# EAGLE schematic regsimple2addfp (EAGLE 7.6.0)

## Sheet 1 of 2: BUS
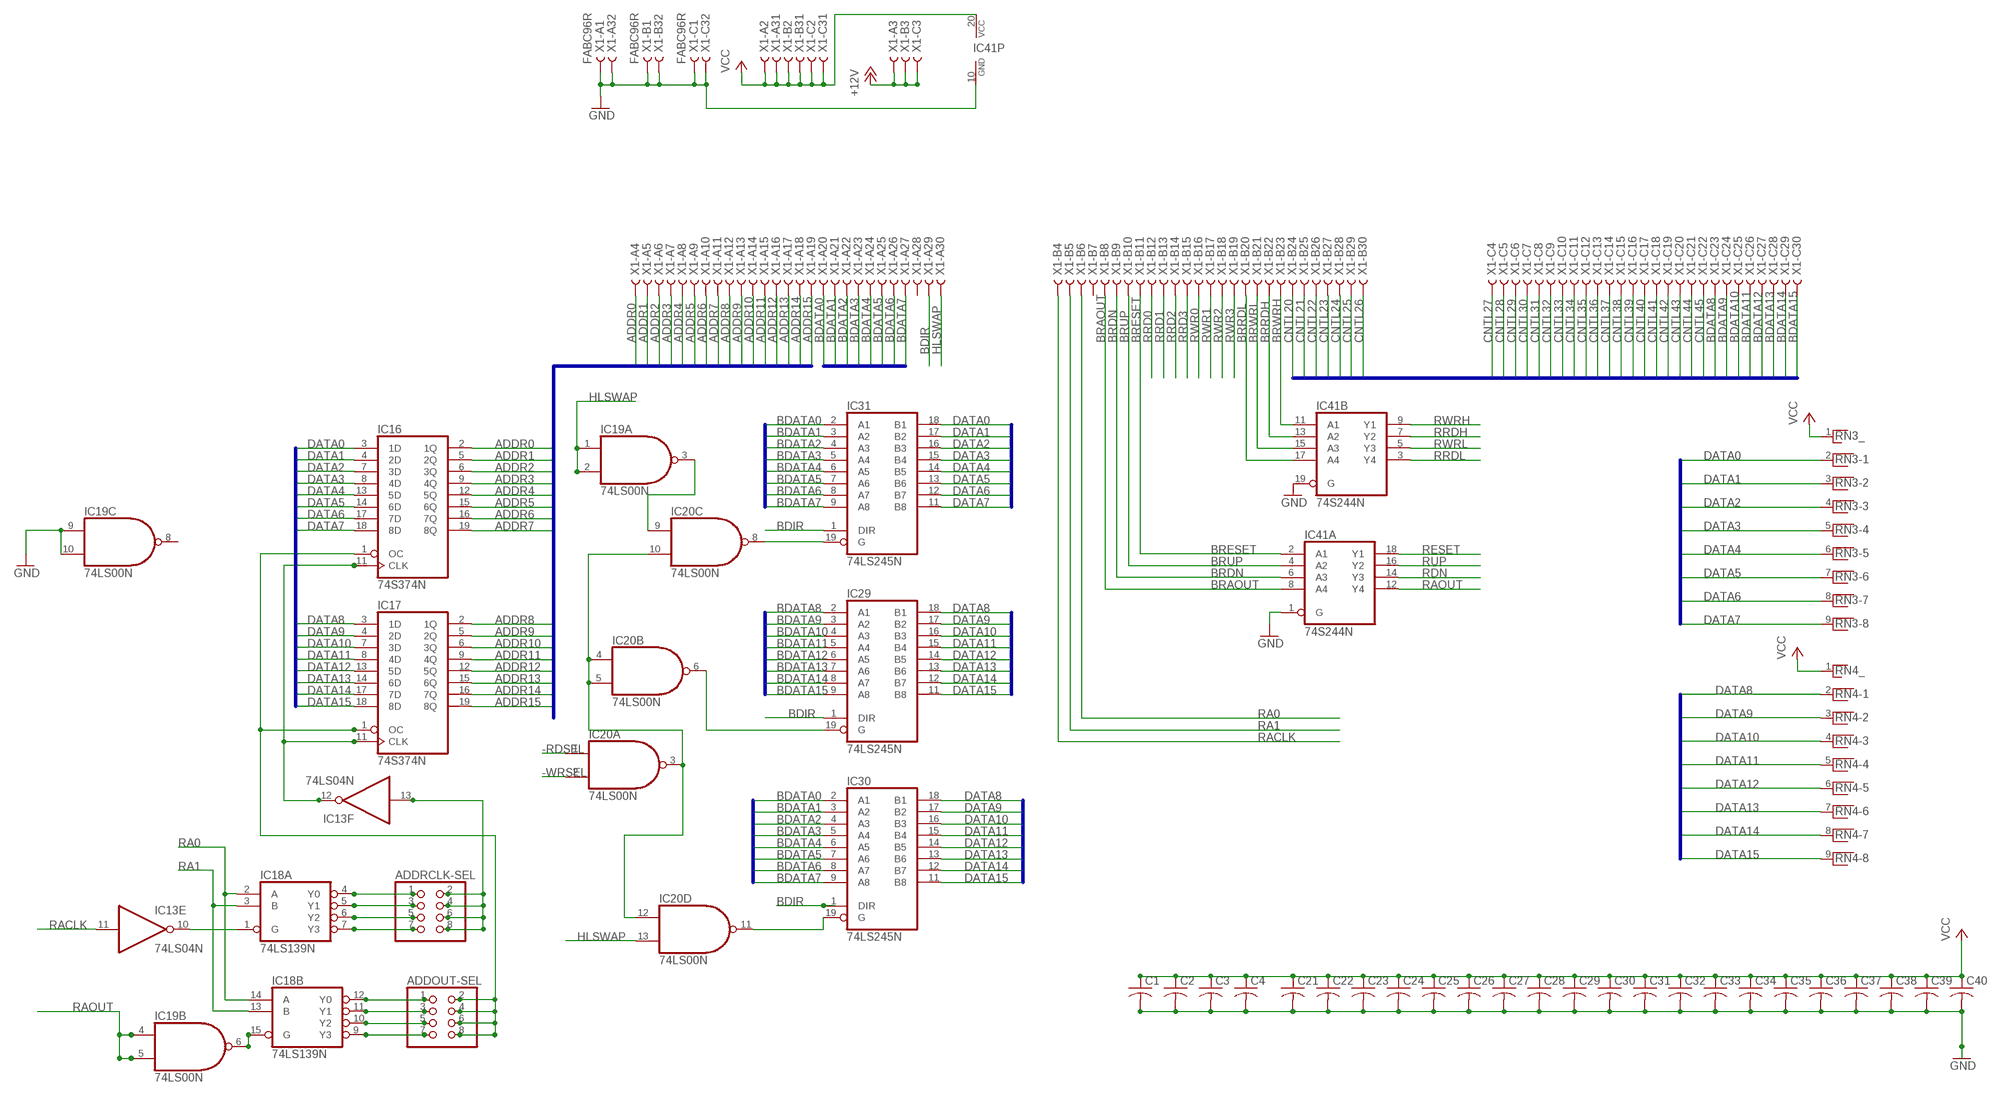
[diagram p0: schematic, sheet 1]

### Parts
ADDOUT-SEL  PINHD-2X4  [2X04]
ADDRCLK-SEL  PINHD-2X4  [2X04]
C1  C-US025-040X050  [C025-040X050]
C2  C-US025-040X050  [C025-040X050]
C3  C-US025-040X050  [C025-040X050]
C4  C-US025-040X050  [C025-040X050]
C21  C-US025-040X050  [C025-040X050]
C22  C-US025-040X050  [C025-040X050]
C23  C-US025-040X050  [C025-040X050]
C24  C-US025-040X050  [C025-040X050]
C25  C-US025-040X050  [C025-040X050]
C26  C-US025-040X050  [C025-040X050]
C27  C-US025-040X050  [C025-040X050]
C28  C-US025-040X050  [C025-040X050]
C29  C-US025-040X050  [C025-040X050]
C30  C-US025-040X050  [C025-040X050]
C31  C-US025-040X050  [C025-040X050]
C32  C-US025-040X050  [C025-040X050]
C33  C-US025-040X050  [C025-040X050]
C34  C-US025-040X050  [C025-040X050]
C35  C-US025-040X050  [C025-040X050]
C36  C-US025-040X050  [C025-040X050]
C37  C-US025-040X050  [C025-040X050]
C38  C-US025-040X050  [C025-040X050]
C39  C-US025-040X050  [C025-040X050]
C40  C-US025-040X050  [C025-040X050]
IC13  74LS04N  [DIL14]
IC16  74S374N  [DIL20]
IC17  74S374N  [DIL20]
IC18  74LS139N  [DIL16]
IC19  74LS00N  [DIL14]
IC20  74LS00N  [DIL14]
IC29  74LS245N  [DIL20]
IC30  74LS245N  [DIL20]
IC31  74LS245N  [DIL20]
IC41  74S244N  [DIL20]
RN3  RNX8  [RN-9]
RN4  RNX8  [RN-9]
X1  FABC96R  [FABC96R]

### Nets
+12V: X1.A3 X1.B3 X1.C3
-RDSEL: IC20.1(A:I0) ; also sheet 2
-WRSEL: IC20.2(A:I1) ; also sheet 2
ADDR0: IC16.2(1Q) X1.A4
ADDR1: IC16.5(2Q) X1.A5
ADDR2: IC16.6(3Q) X1.A6
ADDR3: IC16.9(4Q) X1.A7
ADDR4: IC16.12(5Q) X1.A8
ADDR5: IC16.15(6Q) X1.A9
ADDR6: IC16.16(7Q) X1.A10
ADDR7: IC16.19(8Q) X1.A11
ADDR8: IC17.2(1Q) X1.A12
ADDR9: IC17.5(2Q) X1.A13
ADDR10: IC17.6(3Q) X1.A14
ADDR11: IC17.9(4Q) X1.A15
ADDR12: IC17.12(5Q) X1.A16
ADDR13: IC17.15(6Q) X1.A17
ADDR14: IC17.16(7Q) X1.A18
ADDR15: IC17.19(8Q) X1.A19
BDATA0: IC30.2(A1) IC31.2(A1) X1.A20
BDATA1: IC30.3(A2) IC31.3(A2) X1.A21
BDATA2: IC30.4(A3) IC31.4(A3) X1.A22
BDATA3: IC30.5(A4) IC31.5(A4) X1.A23
BDATA4: IC30.6(A5) IC31.6(A5) X1.A24
BDATA5: IC30.7(A6) IC31.7(A6) X1.A25
BDATA6: IC30.8(A7) IC31.8(A7) X1.A26
BDATA7: IC30.9(A8) IC31.9(A8) X1.A27
BDATA8: IC29.2(A1) X1.C23
BDATA9: IC29.3(A2) X1.C24
BDATA10: IC29.4(A3) X1.C25
BDATA11: IC29.5(A4) X1.C26
BDATA12: IC29.6(A5) X1.C27
BDATA13: IC29.7(A6) X1.C28
BDATA14: IC29.8(A7) X1.C29
BDATA15: IC29.9(A8) X1.C30
BDIR: IC29.1(DIR) IC30.1(DIR) IC31.1(DIR) X1.A29
BRAOUT: IC41.8(A:A4) X1.B8
BRDN: IC41.6(A:A3) X1.B9
BRESET: IC41.2(A:A1) X1.B11
BRRDH: IC41.13(B:A2) X1.B22
BRRDL: IC41.17(B:A4) X1.B20
BRUP: IC41.4(A:A2) X1.B10
BRWRH: IC41.11(B:A1) X1.B23
BRWRL: IC41.15(B:A3) X1.B21
CNTL20: X1.B24
CNTL21: X1.B25
CNTL22: X1.B26
CNTL23: X1.B27
CNTL24: X1.B28
CNTL25: X1.B29
CNTL26: X1.B30
CNTL27: X1.C4
CNTL28: X1.C5
CNTL29: X1.C6
CNTL30: X1.C7
CNTL31: X1.C8
CNTL32: X1.C9
CNTL33: X1.C10
CNTL34: X1.C11
CNTL35: X1.C12
CNTL36: X1.C13
CNTL37: X1.C14
CNTL38: X1.C15
CNTL39: X1.C16
CNTL40: X1.C17
CNTL41: X1.C18
CNTL42: X1.C19
CNTL43: X1.C20
CNTL44: X1.C21
CNTL45: X1.C22
DATA0: IC16.3(1D) IC31.18(B1) RN3.2 ; also sheet 2
DATA1: IC16.4(2D) IC31.17(B2) RN3.3 ; also sheet 2
DATA2: IC16.7(3D) IC31.16(B3) RN3.4 ; also sheet 2
DATA3: IC16.8(4D) IC31.15(B4) RN3.5 ; also sheet 2
DATA4: IC16.13(5D) IC31.14(B5) RN3.6 ; also sheet 2
DATA5: IC16.14(6D) IC31.13(B6) RN3.7 ; also sheet 2
DATA6: IC16.17(7D) IC31.12(B7) RN3.8 ; also sheet 2
DATA7: IC16.18(8D) IC31.11(B8) RN3.9 ; also sheet 2
DATA8: IC17.3(1D) IC29.18(B1) IC30.18(B1) RN4.2 ; also sheet 2
DATA9: IC17.4(2D) IC29.17(B2) IC30.17(B2) RN4.3 ; also sheet 2
DATA10: IC17.7(3D) IC29.16(B3) IC30.16(B3) RN4.4 ; also sheet 2
DATA11: IC17.8(4D) IC29.15(B4) IC30.15(B4) RN4.5 ; also sheet 2
DATA12: IC17.13(5D) IC29.14(B5) IC30.14(B5) RN4.6 ; also sheet 2
DATA13: IC17.14(6D) IC29.13(B6) IC30.13(B6) RN4.7 ; also sheet 2
DATA14: IC17.17(7D) IC29.12(B7) IC30.12(B7) RN4.8 ; also sheet 2
DATA15: IC17.18(8D) IC29.11(B8) IC30.11(B8) RN4.9 ; also sheet 2
GND: C1.2 C2.2 C3.2 C4.2 C21.2 C22.2 C23.2 C24.2 C25.2 C26.2 C27.2 C28.2 C29.2 C30.2 C31.2 C32.2 C33.2 C34.2 C35.2 C36.2 C37.2 C38.2 C39.2 C40.2 IC19.9(C:I0) IC19.10(C:I1) IC41.1(A:G) IC41.10(P:GND) IC41.19(B:G) X1.A1 X1.A32 X1.B1 X1.B32 X1.C1 X1.C32 ; also sheet 2
HLSWAP: IC19.1(A:I0) IC19.2(A:I1) IC20.13(D:I1) X1.A30
N$11: ADDOUT-SEL.1 IC18.12(B:Y0)
N$14: ADDRCLK-SEL.2 ADDRCLK-SEL.4 ADDRCLK-SEL.6 ADDRCLK-SEL.8 IC13.13(F:I)
N$27: ADDRCLK-SEL.1 IC18.4(A:Y0)
N$28: ADDRCLK-SEL.3 IC18.5(A:Y1)
N$29: ADDRCLK-SEL.5 IC18.6(A:Y2)
N$30: ADDRCLK-SEL.7 IC18.7(A:Y3)
N$31: ADDOUT-SEL.2 ADDOUT-SEL.4 ADDOUT-SEL.6 ADDOUT-SEL.8 IC16.1(OC) IC17.1(OC)
N$32: IC13.10(E:O) IC18.1(A:G)
N$33: IC13.12(F:O) IC16.11(CLK) IC17.11(CLK)
N$34: ADDOUT-SEL.3 IC18.11(B:Y1)
N$35: ADDOUT-SEL.5 IC18.10(B:Y2)
N$36: ADDOUT-SEL.7 IC18.9(B:Y3)
N$37: IC20.11(D:O) IC30.19(G)
N$38: IC20.8(C:O) IC31.19(G)
N$39: IC20.6(B:O) IC29.19(G)
N$40: IC20.3(A:O) IC20.4(B:I0) IC20.5(B:I1) IC20.10(C:I1) IC20.12(D:I0)
N$41: IC19.3(A:O) IC20.9(C:I0)
N$42: IC18.15(B:G) IC19.6(B:O)
RA0: IC18.2(A:A) IC18.14(B:A) X1.B6
RA1: IC18.3(A:B) IC18.13(B:B) X1.B5
RACLK: IC13.11(E:I) X1.B4
RAOUT: IC19.4(B:I0) IC19.5(B:I1) IC41.12(A:Y4)
RDN: IC41.14(A:Y3)
RESET: IC41.18(A:Y1)
RRD0: X1.B12 ; also sheet 2
RRD1: X1.B13 ; also sheet 2
RRD2: X1.B14 ; also sheet 2
RRD3: X1.B15 ; also sheet 2
RRDH: IC41.7(B:Y2) ; also sheet 2
RRDL: IC41.3(B:Y4) ; also sheet 2
RUP: IC41.16(A:Y2)
RWR0: X1.B16 ; also sheet 2
RWR1: X1.B17 ; also sheet 2
RWR2: X1.B18 ; also sheet 2
RWR3: X1.B19 ; also sheet 2
RWRH: IC41.9(B:Y1) ; also sheet 2
RWRL: IC41.5(B:Y3) ; also sheet 2
VCC: C1.1 C2.1 C3.1 C4.1 C21.1 C22.1 C23.1 C24.1 C25.1 C26.1 C27.1 C28.1 C29.1 C30.1 C31.1 C32.1 C33.1 C34.1 C35.1 C36.1 C37.1 C38.1 C39.1 C40.1 IC41.20(P:VCC) RN3.1 RN4.1 X1.A2 X1.A31 X1.B2 X1.B31 X1.C2 X1.C31
Unconnected: IC19.8(C:O) X1.A28 X1.B7

### Buses
ADDR[0..15]
BDATA[0..7]
CNTL[0..53],BDATA[8..15]
DATA[8..15]
DATA[0..7]
BDATA[8..15]
DATA[0..15]

## Sheet 2 of 2: Registers
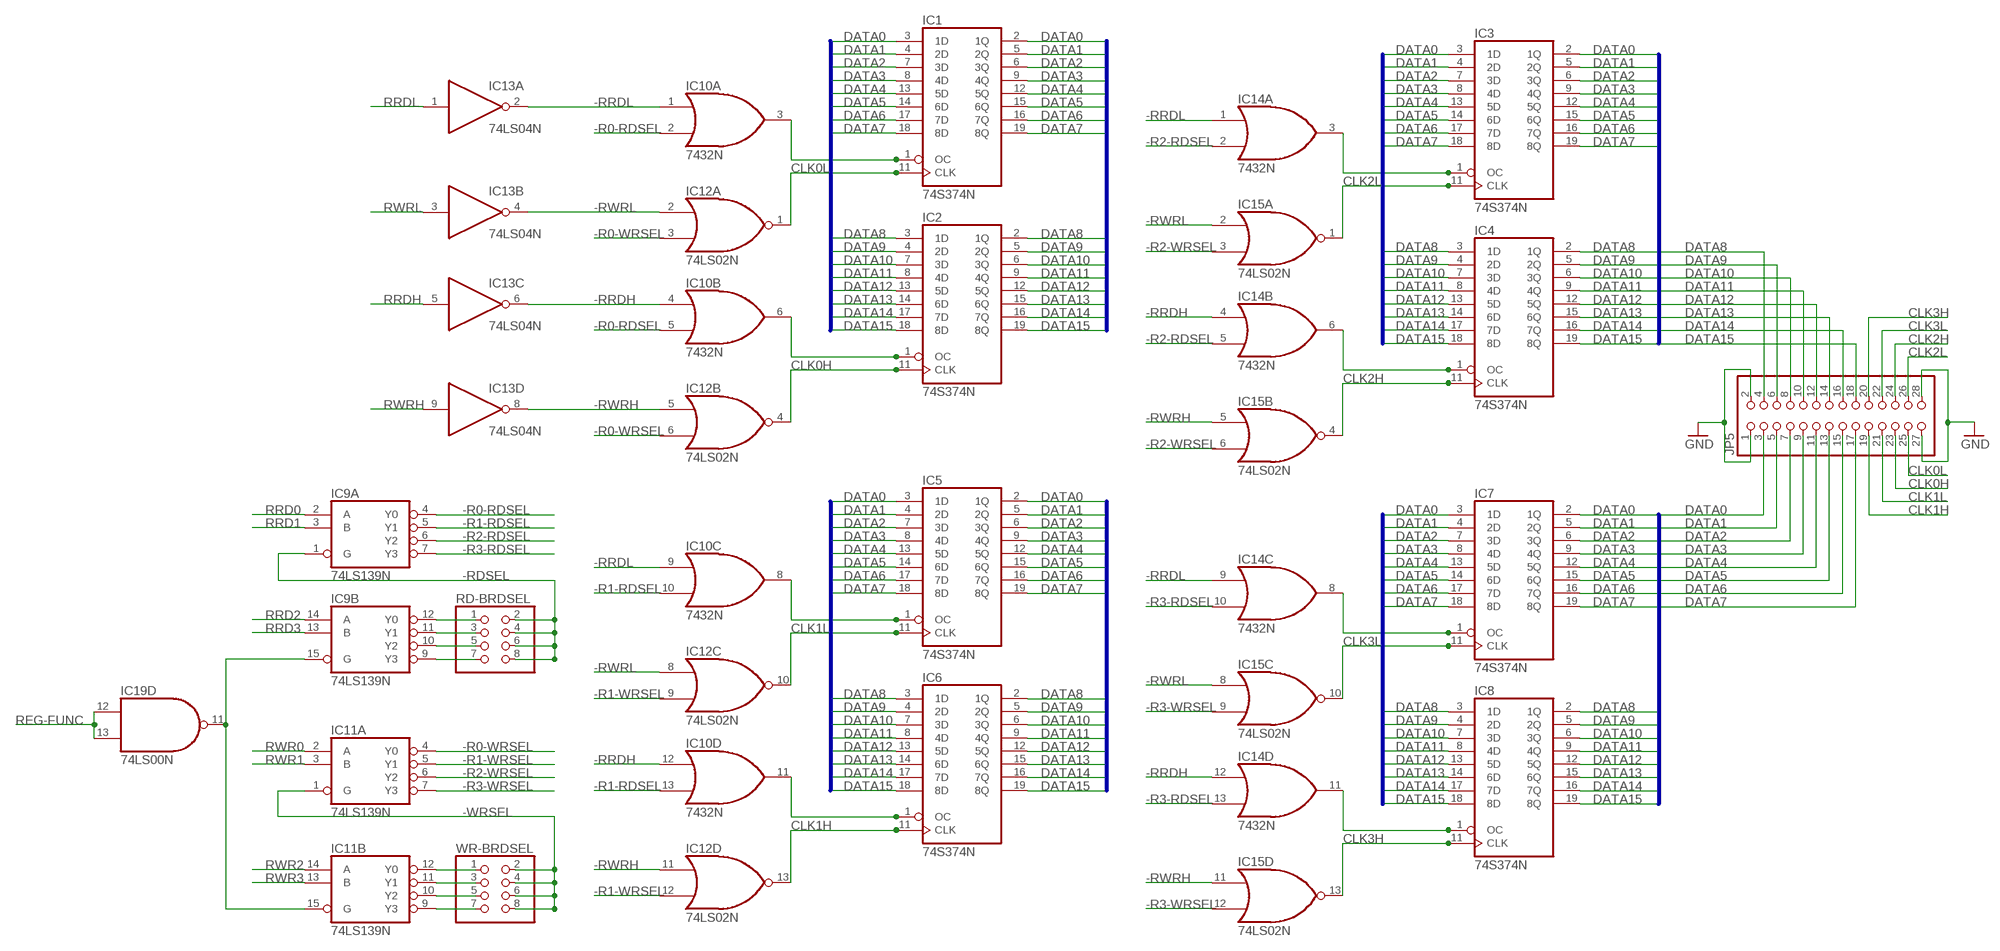
[diagram p1: schematic, sheet 2]

### Parts
IC1  74S374N  [DIL20]
IC2  74S374N  [DIL20]
IC3  74S374N  [DIL20]
IC4  74S374N  [DIL20]
IC5  74S374N  [DIL20]
IC6  74S374N  [DIL20]
IC7  74S374N  [DIL20]
IC8  74S374N  [DIL20]
IC9  74LS139N  [DIL16]
IC10  7432N  [DIL14]
IC11  74LS139N  [DIL16]
IC12  74LS02N  [DIL14]
IC14  7432N  [DIL14]
IC15  74LS02N  [DIL14]
JP5  PINHD-2X14  [2X14]
RD-BRDSEL  PINHD-2X4  [2X04]
WR-BRDSEL  PINHD-2X4  [2X04]

### Nets
-R0-RDSEL: IC9.4(A:Y0) IC10.2(A:I1) IC10.5(B:I1)
-R0-WRSEL: IC11.4(A:Y0) IC12.3(A:I1) IC12.6(B:I1)
-R1-RDSEL: IC9.5(A:Y1) IC10.10(C:I1) IC10.13(D:I1)
-R1-WRSEL: IC11.5(A:Y1) IC12.9(C:I1) IC12.12(D:I1)
-R2-RDSEL: IC9.6(A:Y2) IC14.2(A:I1) IC14.5(B:I1)
-R2-WRSEL: IC11.6(A:Y2) IC15.3(A:I1) IC15.6(B:I1)
-R3-RDSEL: IC9.7(A:Y3) IC14.10(C:I1) IC14.13(D:I1)
-R3-WRSEL: IC11.7(A:Y3) IC15.9(C:I1) IC15.12(D:I1)
-RDSEL: IC9.1(A:G) RD-BRDSEL.2 RD-BRDSEL.4 RD-BRDSEL.6 RD-BRDSEL.8 ; also sheet 1
-RRDH: IC10.4(B:I0) IC10.12(D:I0) IC13.6(C:O) IC14.4(B:I0) IC14.12(D:I0)
-RRDL: IC10.1(A:I0) IC10.9(C:I0) IC13.2(A:O) IC14.1(A:I0) IC14.9(C:I0)
-RWRH: IC12.5(B:I0) IC12.11(D:I0) IC13.8(D:O) IC15.5(B:I0) IC15.11(D:I0)
-RWRL: IC12.2(A:I0) IC12.8(C:I0) IC13.4(B:O) IC15.2(A:I0) IC15.8(C:I0)
-WRSEL: IC11.1(A:G) WR-BRDSEL.2 WR-BRDSEL.4 WR-BRDSEL.6 WR-BRDSEL.8 ; also sheet 1
CLK0H: IC2.11(CLK) IC12.4(B:O) JP5.23
CLK0L: IC1.11(CLK) IC12.1(A:O) JP5.25
CLK1H: IC6.11(CLK) IC12.13(D:O) JP5.19
CLK1L: IC5.11(CLK) IC12.10(C:O) JP5.21
CLK2H: IC4.11(CLK) IC15.4(B:O) JP5.24
CLK2L: IC3.11(CLK) IC15.1(A:O) JP5.26
CLK3H: IC8.11(CLK) IC15.13(D:O) JP5.20
CLK3L: IC7.11(CLK) IC15.10(C:O) JP5.22
DATA0: IC1.2(1Q) IC1.3(1D) IC3.2(1Q) IC3.3(1D) IC5.2(1Q) IC5.3(1D) IC7.2(1Q) IC7.3(1D) JP5.3 ; also sheet 1
DATA1: IC1.4(2D) IC1.5(2Q) IC3.4(2D) IC3.5(2Q) IC5.4(2D) IC5.5(2Q) IC7.4(2D) IC7.5(2Q) JP5.5 ; also sheet 1
DATA2: IC1.6(3Q) IC1.7(3D) IC3.6(3Q) IC3.7(3D) IC5.6(3Q) IC5.7(3D) IC7.6(3Q) IC7.7(3D) JP5.7 ; also sheet 1
DATA3: IC1.8(4D) IC1.9(4Q) IC3.8(4D) IC3.9(4Q) IC5.8(4D) IC5.9(4Q) IC7.8(4D) IC7.9(4Q) JP5.9 ; also sheet 1
DATA4: IC1.12(5Q) IC1.13(5D) IC3.12(5Q) IC3.13(5D) IC5.12(5Q) IC5.13(5D) IC7.12(5Q) IC7.13(5D) JP5.11 ; also sheet 1
DATA5: IC1.14(6D) IC1.15(6Q) IC3.14(6D) IC3.15(6Q) IC5.14(6D) IC5.15(6Q) IC7.14(6D) IC7.15(6Q) JP5.13 ; also sheet 1
DATA6: IC1.16(7Q) IC1.17(7D) IC3.16(7Q) IC3.17(7D) IC5.16(7Q) IC5.17(7D) IC7.16(7Q) IC7.17(7D) JP5.15 ; also sheet 1
DATA7: IC1.18(8D) IC1.19(8Q) IC3.18(8D) IC3.19(8Q) IC5.18(8D) IC5.19(8Q) IC7.18(8D) IC7.19(8Q) JP5.17 ; also sheet 1
DATA8: IC2.2(1Q) IC2.3(1D) IC4.2(1Q) IC4.3(1D) IC6.2(1Q) IC6.3(1D) IC8.2(1Q) IC8.3(1D) JP5.4 ; also sheet 1
DATA9: IC2.4(2D) IC2.5(2Q) IC4.4(2D) IC4.5(2Q) IC6.4(2D) IC6.5(2Q) IC8.4(2D) IC8.5(2Q) JP5.6 ; also sheet 1
DATA10: IC2.6(3Q) IC2.7(3D) IC4.6(3Q) IC4.7(3D) IC6.6(3Q) IC6.7(3D) IC8.6(3Q) IC8.7(3D) JP5.8 ; also sheet 1
DATA11: IC2.8(4D) IC2.9(4Q) IC4.8(4D) IC4.9(4Q) IC6.8(4D) IC6.9(4Q) IC8.8(4D) IC8.9(4Q) JP5.10 ; also sheet 1
DATA12: IC2.12(5Q) IC2.13(5D) IC4.12(5Q) IC4.13(5D) IC6.12(5Q) IC6.13(5D) IC8.12(5Q) IC8.13(5D) JP5.12 ; also sheet 1
DATA13: IC2.14(6D) IC2.15(6Q) IC4.14(6D) IC4.15(6Q) IC6.14(6D) IC6.15(6Q) IC8.14(6D) IC8.15(6Q) JP5.14 ; also sheet 1
DATA14: IC2.16(7Q) IC2.17(7D) IC4.16(7Q) IC4.17(7D) IC6.16(7Q) IC6.17(7D) IC8.16(7Q) IC8.17(7D) JP5.16 ; also sheet 1
DATA15: IC2.18(8D) IC2.19(8Q) IC4.18(8D) IC4.19(8Q) IC6.18(8D) IC6.19(8Q) IC8.18(8D) IC8.19(8Q) JP5.18 ; also sheet 1
GND: JP5.1 JP5.2 JP5.27 JP5.28 ; also sheet 1
N$1: IC1.1(OC) IC10.3(A:O)
N$2: IC9.12(B:Y0) RD-BRDSEL.1
N$3: IC9.11(B:Y1) RD-BRDSEL.3
N$4: IC9.10(B:Y2) RD-BRDSEL.5
N$5: IC9.9(B:Y3) RD-BRDSEL.7
N$6: IC11.12(B:Y0) WR-BRDSEL.1
N$7: IC11.11(B:Y1) WR-BRDSEL.3
N$8: IC11.10(B:Y2) WR-BRDSEL.5
N$9: IC11.9(B:Y3) WR-BRDSEL.7
N$12: IC5.1(OC) IC10.8(C:O)
N$13: IC9.15(B:G) IC11.15(B:G) IC19.11(D:O)
N$15: IC3.1(OC) IC14.3(A:O)
N$17: IC7.1(OC) IC14.8(C:O)
N$19: IC6.1(OC) IC10.11(D:O)
N$21: IC8.1(OC) IC14.11(D:O)
N$23: IC4.1(OC) IC14.6(B:O)
N$25: IC2.1(OC) IC10.6(B:O)
REG-FUNC: IC19.12(D:I0) IC19.13(D:I1)
RRD0: IC9.2(A:A) ; also sheet 1
RRD1: IC9.3(A:B) ; also sheet 1
RRD2: IC9.14(B:A) ; also sheet 1
RRD3: IC9.13(B:B) ; also sheet 1
RRDH: IC13.5(C:I) ; also sheet 1
RRDL: IC13.1(A:I) ; also sheet 1
RWR0: IC11.2(A:A) ; also sheet 1
RWR1: IC11.3(A:B) ; also sheet 1
RWR2: IC11.14(B:A) ; also sheet 1
RWR3: IC11.13(B:B) ; also sheet 1
RWRH: IC13.9(D:I) ; also sheet 1
RWRL: IC13.3(B:I) ; also sheet 1

### Buses
DATA[0..15]

## Power pins joined to a net without a drawn wire
GND: IC1.10(GND) IC2.10(GND) IC3.10(GND) IC4.10(GND) IC5.10(GND) IC6.10(GND) IC7.10(GND) IC8.10(GND) IC9.8(P:GND) IC10.7(P:GND) IC11.8(P:GND) IC12.7(P:GND) IC13.7(P:GND) IC14.7(P:GND) IC15.7(P:GND) IC16.10(GND) IC17.10(GND) IC18.8(P:GND) IC19.7(P:GND) IC20.7(P:GND) IC29.10(GND) IC30.10(GND) IC31.10(GND)
VCC: IC1.20(VCC) IC2.20(VCC) IC3.20(VCC) IC4.20(VCC) IC5.20(VCC) IC6.20(VCC) IC7.20(VCC) IC8.20(VCC) IC9.16(P:VCC) IC10.14(P:VCC) IC11.16(P:VCC) IC12.14(P:VCC) IC13.14(P:VCC) IC14.14(P:VCC) IC15.14(P:VCC) IC16.20(VCC) IC17.20(VCC) IC18.16(P:VCC) IC19.14(P:VCC) IC20.14(P:VCC) IC29.20(VCC) IC30.20(VCC) IC31.20(VCC)

## Library data of the parts
ADDOUT-SEL ADDRCLK-SEL RD-BRDSEL WR-BRDSEL = pinhead:PINHD-2X4: PIN HEADER
C1-C4 C21-C40 = rcl:C-US: CAPACITOR, American symbol
IC1-IC8 IC16 IC17 = 74xx-us:74*374: Octal D type transparent LATCH, edge triggered
IC9 IC11 IC18 = 74xx-us:74*139: Dual 2-line to 4-line DECODER/DEMULTIPLEXER
IC10 IC14 = 74xx-us:74*32: Quad 2-input OR gate
IC12 IC15 = 74xx-us:74*02: Quad 2-input NOR gate
IC13 = 74xx-us:74*04: Hex INVERTER
IC19 IC20 = 74xx-us:74*00: Quad 2-input NAND gate
IC29-IC31 = 74xx-us:74*245: Octal BUS TRANSCEIVER, 3-state
IC41 = 74xx-eu:74*244: Octal BUFFER and LINE DRIVER, 3-state
JP5 = pinhead:PINHD-2X14: PIN HEADER
RN3 RN4 = resistor-net:RNX8: RESISTOR NETWORK; OC_FARNELL: unknown; OC_NEWARK: unknown
X1 = con-vg:FABC96R: CONNECTOR female, 96 pins, type R, rows ABC, grid 2.54 mm